# EAGLE design SSB Transceiver_Supply EMI Filter (EAGLE 9.4.2)
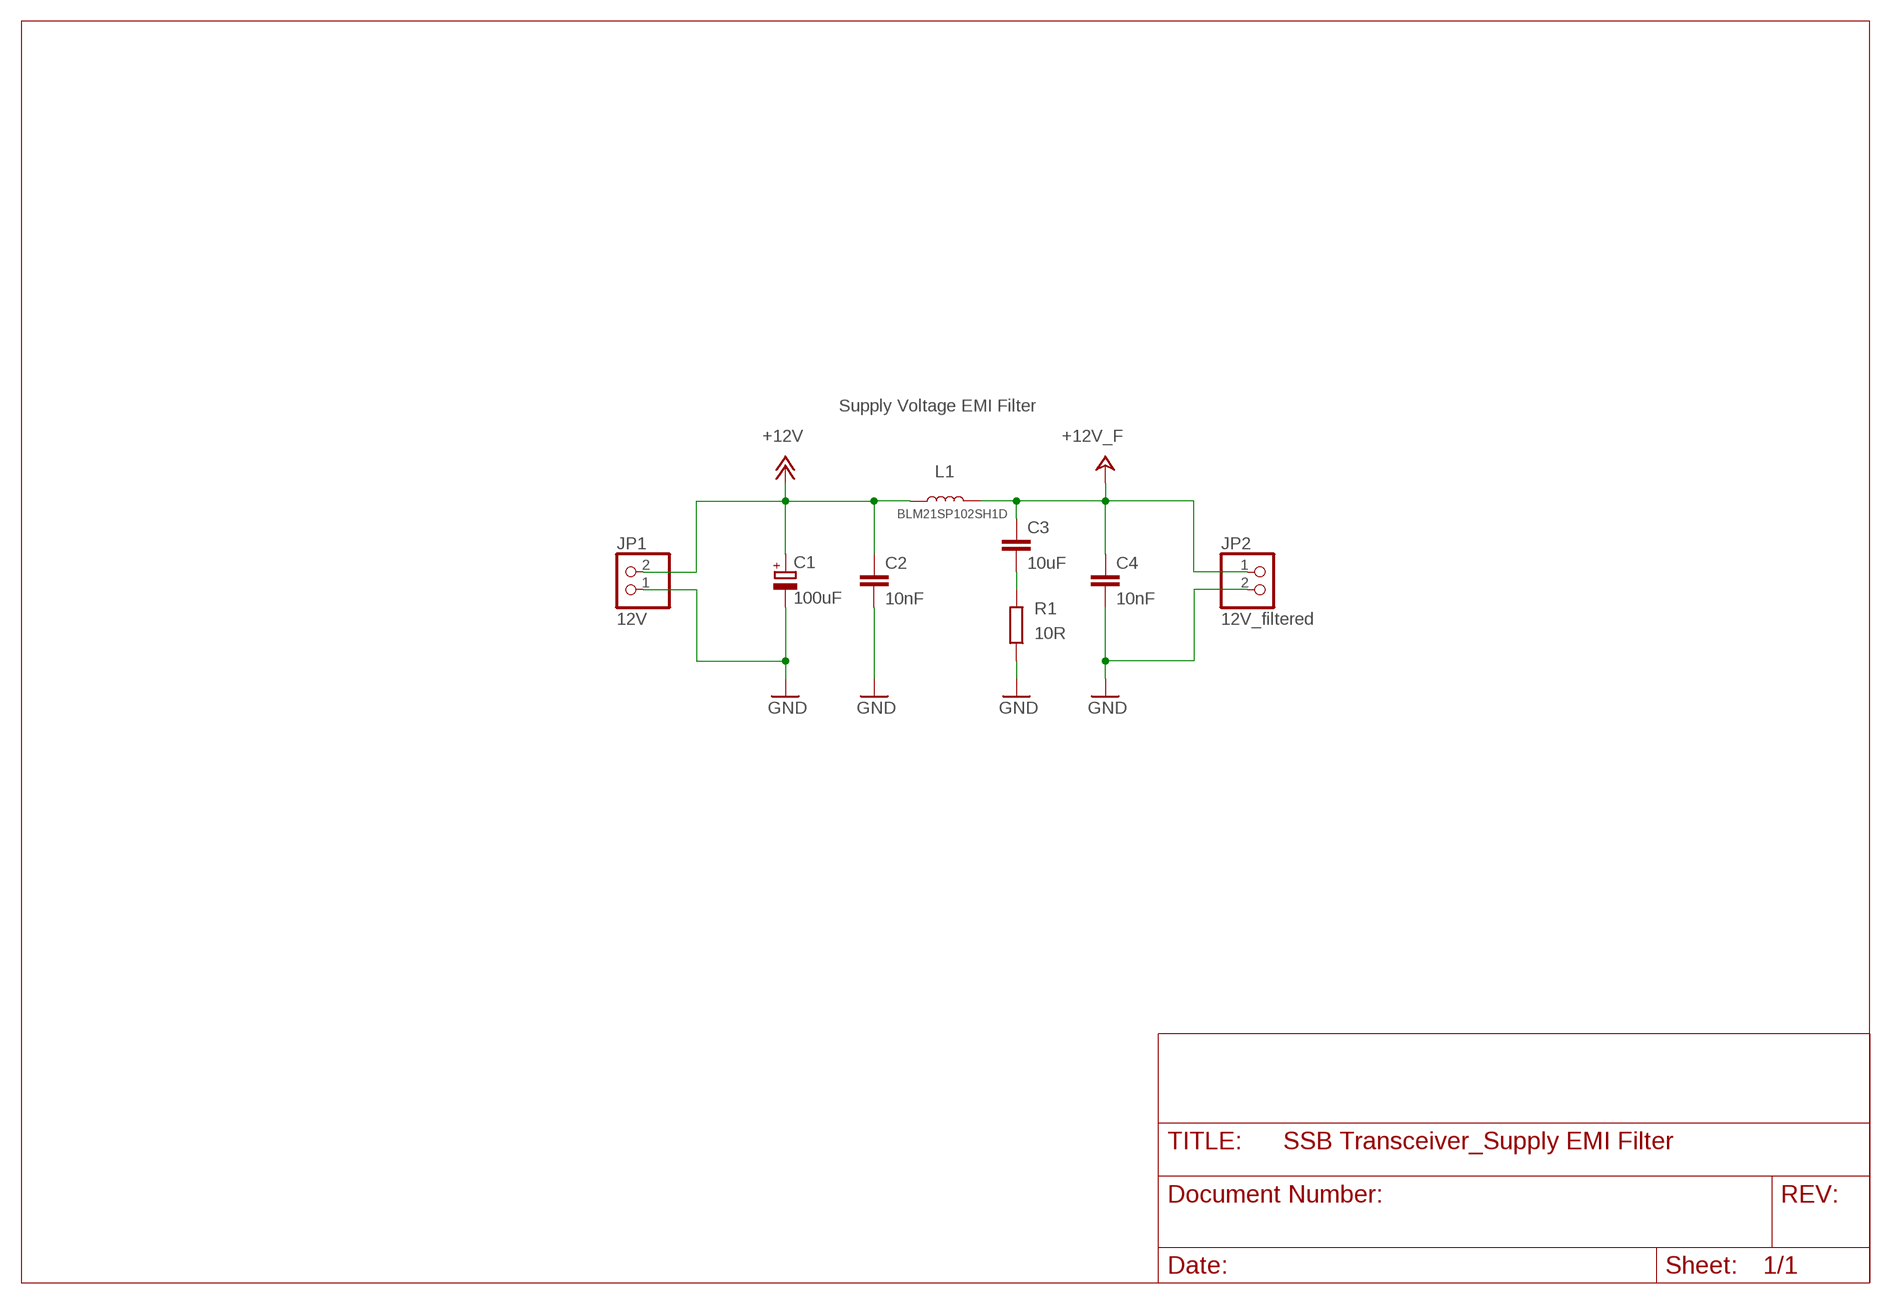
[diagram p0: schematic, sheet 1]

## Parts
C1  100uF  CPOL-EUE2.5-7  [E2,5-7]
C2  10nF  C-EUC0805  [C0805]
C3  10uF  C-EUC0805  [C0805]
C4  10nF  C-EUC0805  [C0805]
JP1  12V  PINHD-1X2  [1X02]
JP2  12V_filtered  PINHD-1X2  [1X02]
L1  BLM21SP102SH1D  INDUCTOR-0805-3.3UH  [0805]
R1  10R  R-EU_R0805  [R0805]

## Nets
+12V: C1.+ C2.1 JP1.2 L1.1
+24V: C3.1 C4.1 JP2.1 L1.2 ; supply symbol labelled +12V_F
GND: C1.- C2.2 C4.2 JP1.1 JP2.2 R1.1
N$3: C3.2 R1.2

## Notes on the sheet
- Supply Voltage EMI Filter

## Library data of the parts
C1 = rcl:CPOL-EU: POLARIZED CAPACITOR, European symbol; SPICEPREFIX: C
C2-C4 = rcl:C-EU: CAPACITOR, European symbol; SPICEPREFIX: C
JP1 JP2 = pinhead:PINHD-1X2: PIN HEADER
L1 = SparkFun-Coils:INDUCTOR: Inductors Resist changes in electrical current. Basically a coil of wire. SparkFun Products: SparkFun Load Cell Amplifier - HX711 <https://www.sparkfun.com/products/13879> IOIO-OTG - V2.2 <https://www.sparkfun.com/products/13613>; PROD_ID: NDUC-13076; VALUE: 3.3µH/±20%/450mA
R1 = rcl:R-EU_: RESISTOR, European symbol; SPICEPREFIX: R

## Board
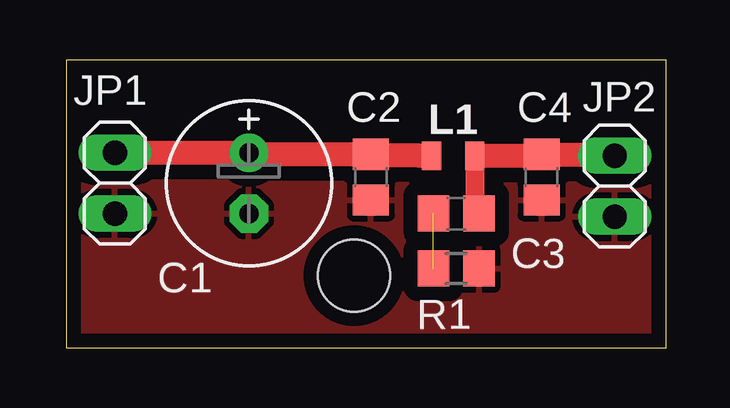
[diagram p1: board, top side]
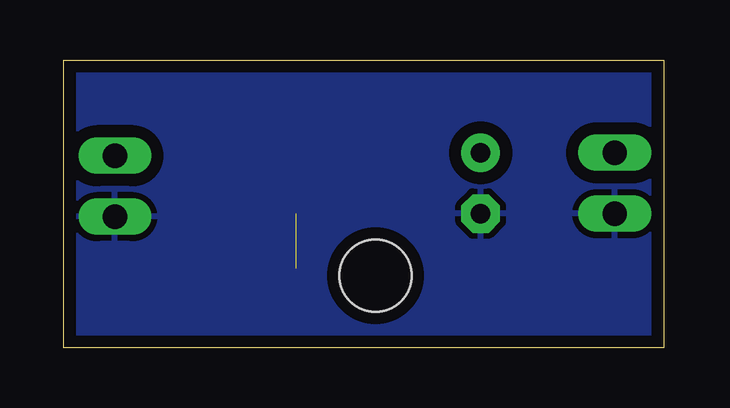
[diagram p2: board, bottom side, seen from below]

Size 25 x 12 mm. Coordinates in mm from the lower left corner, seen from the top.
Outline: 0,0 25,0 25,12 0,12 0,0
Copper layers (1*16): Top 0.035mm / dielectric 1.5mm / Bottom 0.035mm
Design rules "default *": minimum track width 6mil, minimum drill 0.35mm, track to track 20mil, track to pad 20mil, pad to pad 20mil, via to via 20mil, smd to smd 6mil, copper to edge 20mil, drill to drill 6mil, minimum pad ring 10mil, minimum via ring 8mil, stop-mask expansion 4mil, vias tented up to drill 0mil, thermal gap 10mil
Holes 3 mm at 12,3

### Footprints (pad centres in the part's own frame; a part is rotated, then mirrored left to right if it is on the bottom)
E2,5-7 = drill 0.813 pad 1.6: + -1.27,0 | drill 0.813 pad 1.6 octagon: - 1.27,0
C0805 = smd 1.3 x 1.5: 1 -0.95,0; 2 0.95,0
1X02 = drill 1.016 long: 1 -1.27,0; 2 1.27,0
0805 = smd 0.8 x 1.2: 1 -0.9,0; 2 0.9,0
R0805 = smd 1.3 x 1.5: 1 -0.95,0; 2 0.95,0

### Placement (x,y rotation side)
C1  7.62,6.86 270 top
C2  12.7,7.11 270 top
C3  16.26,5.59 180 top
C4  19.81,7.11 270 top
JP1  2.03,6.86 90 top
JP2  22.86,6.73 270 top
L1  16.13,8 0 top
R1  16.26,3.3 180 top

### Tracks (layer width: path | path; a pad name or v marks a point on that pad's centre or on a via)
+12V
  Top 0.8: L1.1 14.73,8
  Top 1: JP1.2 C1.+ 7.69,8.06 C2.1 12.76,8 14.73,8
+24V
  Top 0.8: C3.1 17.03,5.76 L1.2 17.53,8
  Top 1: 17.53,8 19.75,8 C4.1 22.8,8.06 JP2.1
GND
  pour Bottom (isolate 0.5): 0,0 0,12 25,12 25,0
  pour Top (isolate 0.6): 0,0 0,12 25,12 25,0
N$3  (1 unrouted)